# EasyEDA schematic SCH_Voltage-Regulator-AMS1117_2026-08-26.json
TITLE: Voltage Regulator AMS1117; REV: 1.0; Date: 2026-08-26; Sheet: 1/1; Drawn By: sherif.os.abdelkareem; Company: syntaxIoT
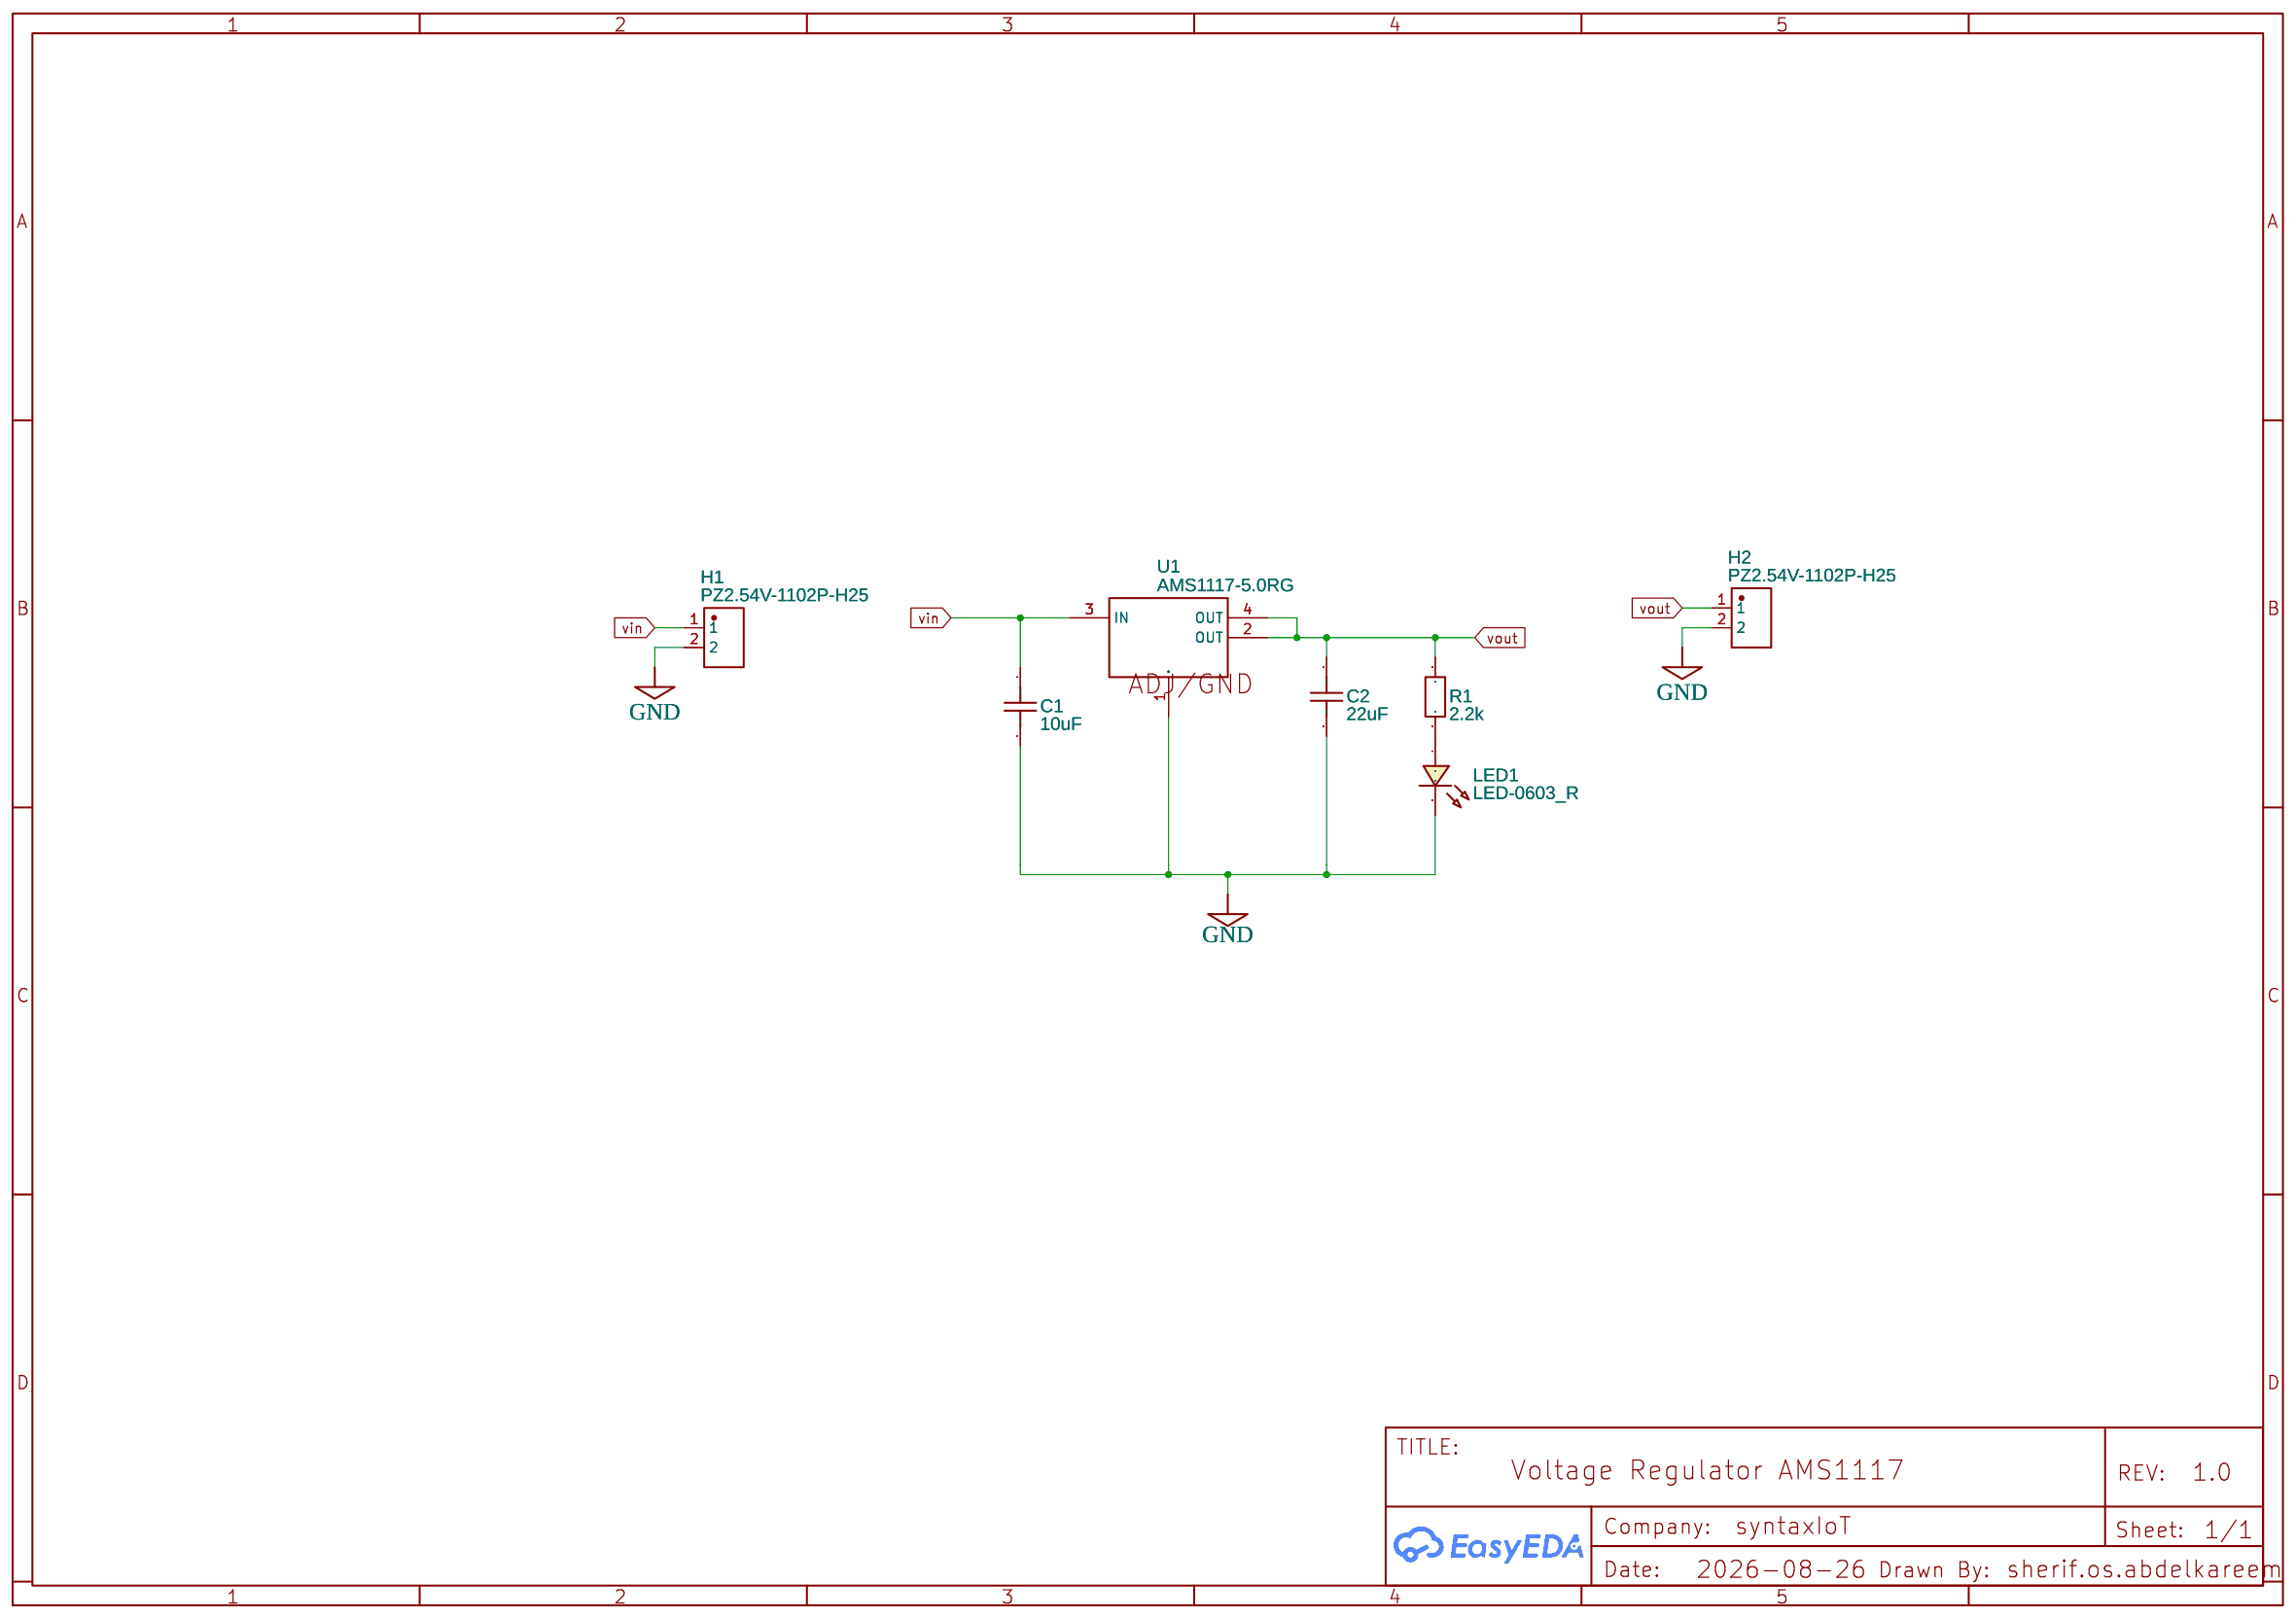
[diagram p0: schematic sheet]

## Parts
C1  10uF  [C0603]
C2  22uF  [C0603]
H1  PZ2.54V-1102P-H25  [HDR-TH_2P-P2.54-V-M-2]
H2  PZ2.54V-1102P-H25  [HDR-TH_2P-P2.54-V-M-2]
LED1  LED-0603_R  [LED0603_RED]
R1  2.2k  [R0603]
U1  AMS1117-5.0RG  [SOT-223-3_L6.4-W3.5-P2.30-LS7.0-BR]

## Library data of the parts
C1 C2 = C_0603_US: Contributor: LCEDA_Lib
H1 H2 = PZ2.54V-1102P-H25: Supplier: LCSC; Supplier Part: C42431681; Manufacturer: JXTCONN(聚兴泰); JLCPCB Part Class: Extended Part; Contributor: lcsc
LED1 = LED-0603_R: Manufacturer: EVERLIGHT(台湾亿光); Manufacturer Part: 19-217/R6C-AL1M2VY/3T; Supplier Part: C72044; Supplier: LCSC; Contributor: LCEDA_01
R1 = R_0603_EU: Contributor: LCEDA_Lib
U1 = AMS1117-5.0RG: Contributor: lcsc; Supplier: LCSC; Supplier Part: C2977151; Manufacturer: HGC(深圳汉芯); JLCPCB Part Class: Extended Part

## Nets
GND: C1.2 C2.2 H1.2 H2.2 LED1.2 U1.1(ADJ/GND)
vin: C1.1 H1.1 U1.3(IN)
vout: C2.1 H2.1 R1.2 U1.2(OUT) U1.4(OUT)
Net-(LED1-1): LED1.1 R1.1
